# Altium schematic sheet DC-DC AJ39.schdoc
size 52 x 35 mm
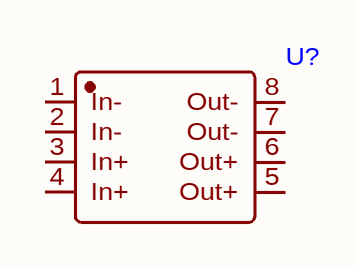
[diagram p0: DC-DC AJ39.schdoc]

## Parts
U?  (no value)  [DC-DC-AJ39]

## Nets

Not connected (* = marked no-connect by the designer): U? 1(In-) 2(In-) 3(In+) 4(In+) 5(Out+) 6(Out+) 7(Out-) 8(Out-)

## Library data of the parts
U? = DC-DC AJ39